# Altium schematic sheet PP_2_0_1.SchDoc
size 209 x 297 mm; PageSetup: Record=PageOptions|CenterHorizontal=True|CenterVertical=True|PrintScale=0.94|XCorrection=1.00|YCorrection=1.00|PrintKind=2|BorderSize=5000000|LeftOffset=0|BottomOffset=0|Orientation=1|PaperLength=2970|PaperWidth=2100|Scale=100|PaperSource=7|PrintQuality=600|MediaType=1|DitherType=10|PaperKind=A4|PrintScaleMode=1; Title1str: (вторая строка при необходимости); DocumentType: Тип схемы; DocumentNumber: 53251498.468331.01.04.00 Э3; SheetNumber: 2; Format: A4
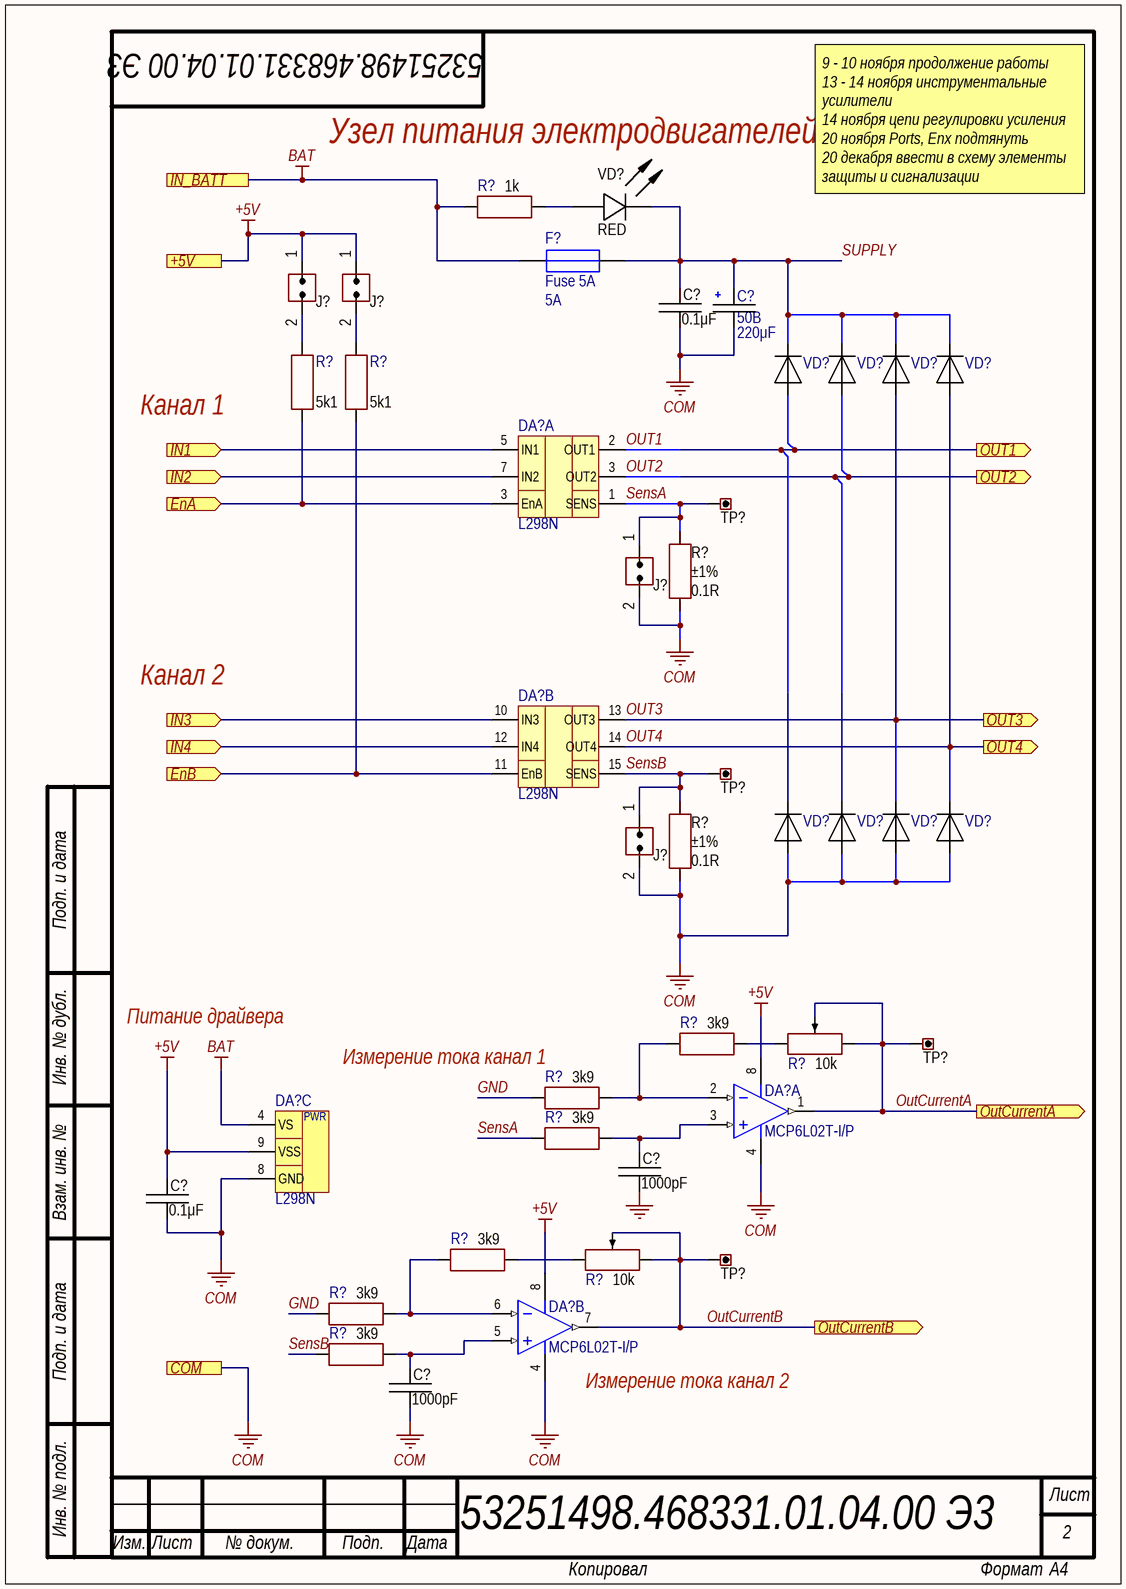
[diagram p0: PP_2_0_1.SchDoc]

## Parts
(Parts that share a designator on the sheet are numbered #1, #2 ... from top to bottom, then left to right.)
C?#1  value 0.1μF  [CAP: 0805, Thru-Hole]
C?#2  value 220μF  Voltage: 50В  [CAP: RB2-5]  (hidden comment: Cap Pol1)
C?#3  value 1000pF  [CAP: 0805, Thru-Hole]
C?#4  value 0.1μF  [CAP: 0805, Thru-Hole]
C?#5  value 1000pF  [CAP: 0805, Thru-Hole]
DA?#1  L298N  [Multivatt15]  (part A of 3)
DA?#2  L298N  [Multivatt15]  (part B of 3)
DA?#3  MCP6L02T-I/P  [DIP-8]  (part A of 2)
DA?#4  L298N  [Multivatt15]  (part C of 3)
DA?#5  MCP6L02T-I/P  [DIP-8]  (part B of 2)
F?  Fuse 5A  value 5A  [FUSE:MF-R_Style_2]
J?#1  (no value)  [CON: PLS-2]
J?#2  (no value)  [CON: PLS-2]
J?#3  (no value)  [CON: PLS-2]
J?#4  (no value)  [CON: PLS-2]
R?#1  value 1k  [RES:CF-1/4W]
R?#2  value 5k1  [RES:CF-1/4W]
R?#3  value 5k1  [RES:CF-1/4W]
R?#4  value 0.1R  Tolerance: ±1%  [RES:CF-1/1W]
R?#5  value 0.1R  Tolerance: ±1%  [RES:CF-1/1W]
R?#6  value 3k9  [RES:CF-1/4W]
R?#7  value 10k  [RES: 3296W]
R?#8  value 3k9  [RES:CF-1/4W]
R?#9  value 3k9  [RES:CF-1/4W]
R?#10  value 3k9  [RES:CF-1/4W]
R?#11  value 10k  [RES: 3296W]
R?#12  value 3k9  [RES:CF-1/4W]
R?#13  value 3k9  [RES:CF-1/4W]
TP?#1  (no value)  [CON: 5000 (Keystone)]
TP?#2  (no value)  [CON: 5000 (Keystone)]
TP?#3  (no value)  [CON: 5000 (Keystone)]
TP?#4  (no value)  [CON: 5000 (Keystone)]
VD?#1  Color: RED  [LED: 3MM_301_R]
VD?#2  (no value)  [DIODE: DO-41]
VD?#3  (no value)  [DIODE: DO-41]
VD?#4  (no value)  [DIODE: DO-41]
VD?#5  (no value)  [DIODE: DO-41]
VD?#6  (no value)  [DIODE: DO-41]
VD?#7  (no value)  [DIODE: DO-41]
VD?#8  (no value)  [DIODE: DO-41]
VD?#9  (no value)  [DIODE: DO-41]

## Ports
+5V, COM, EnA (in), EnB (in), IN1 (in), IN2 (in), IN3 (in), IN4 (in), IN_BATT, OUT1 (out), OUT2 (out), OUT3 (out), OUT4 (out), OutCurrentA (out), OutCurrentB (out)

## Nets
+5V: C?#4.2 DA?#3.8(VDD) DA?#4.9(VSS) DA?#5.8(VDD) J?#1.1(IN) J?#2.1(IN) ; port +5V
BAT: DA?#4.4(VS) F?.1 R?#1.1 ; port IN_BATT
COM: C?#1.1 C?#2.1 C?#3.1 C?#4.1 C?#5.1 DA?#3.4(VSS) DA?#4.8(GND) DA?#5.4(VSS) J?#3.2(IN) J?#4.2(IN) R?#4.1 R?#5.1 VD?#6.1 VD?#7.1 VD?#8.1 VD?#9.1 ; port COM
EnA: DA?#1.3(EnA) R?#2.1 ; port EnA
EnB: DA?#2.11(EnB) R?#3.1 ; port EnB
GND: R?#8.1 R?#12.1
IN1: DA?#1.5(IN1) ; port IN1
IN2: DA?#1.7(IN2) ; port IN2
IN3: DA?#2.10(IN3) ; port IN3
IN4: DA?#2.12(IN4) ; port IN4
OUT1: DA?#1.2(OUT1) VD?#2.1 VD?#6.2 ; port OUT1
OUT2: DA?#1.3(OUT2) VD?#3.1 VD?#7.2 ; port OUT2
OUT3: DA?#2.13(OUT3) VD?#4.1 VD?#8.2 ; port OUT3
OUT4: DA?#2.14(OUT4) VD?#5.1 VD?#9.2 ; port OUT4
OutCurrentA: DA?#3.1(VOUTA) R?#7.2 R?#7.3 TP?#3.1 ; port OutCurrentA
OutCurrentB: DA?#5.7(VOUTB) R?#11.2 R?#11.3 TP?#4.1 ; port OutCurrentB
SensA: DA?#1.1(SENS) J?#3.1(IN) R?#4.2 R?#9.1 TP?#1.1
SensB: DA?#2.15(SENS) J?#4.1(IN) R?#5.2 R?#13.1 TP?#2.1
SUPPLY: C?#1.2 C?#2.2 F?.2 VD?#1.2(C) VD?#2.2 VD?#3.2 VD?#4.2 VD?#5.2
NetC?#3_2: C?#3.2 DA?#3.3(VINA+) R?#9.2
NetC?#5_2: C?#5.2 DA?#5.5(VINB+) R?#13.2
NetDA?#3_2: DA?#3.2(VINA-) R?#6.1 R?#8.2
NetDA?#5_6: DA?#5.6(VINB-) R?#10.1 R?#12.2
NetJ?#1_2: J?#1.2(IN) R?#2.2
NetJ?#2_2: J?#2.2(IN) R?#3.2
NetR?#1_2: R?#1.2 VD?#1.1(A)
NetR?#6_2: R?#6.2 R?#7.1
NetR?#10_2: R?#10.2 R?#11.1

## Notes on the sheet
- Узел питания электродвигателей
- 9 - 10 ноября продолжение работы
  13 - 14 ноября инструментальные усилители
  14 ноября цепи регулировки усиления
  20 ноября Ports, Enx подтянуть
  20 декабря ввести в схему элементы защиты и сигнализации
- Канал 1
- Канал 2
- Питание драйвера
- (near R?#8) Измерение тока канал 1
- (near DA?#5) Измерение тока канал 2
- Подп. и дата
- Инв. № дубл.
- Взам. инв. №
- Инв. № подл.
- Лист
- Изм.
- № докум.
- Подп.
- Дата
- Копировал
- Формат
- (in symbol L298N, part C) PWR

## Library data of the parts
C?#1 C?#4 = Ceramic_0805: К10-17 0805; Manufacturer: Murata; PartNumber: RPEE41H105M3M1C05A; ValueManufacturerPartNumber: Ceramic capacitor, 0.1μF, X7R, ±10%, 50V, 1206, -55...+125°C; TypeCapacitor: Ceramic capacitor; Tolerance: ±10%; TypeDielectric: X7R; Voltage: 50V; Package: 1206; HelpURL: https://www.chipdip.ru/product/rpee41h105m3; Temperature: -55...+125°C
C?#2 = Cap Pol1: ECAP (К50-35), 220мкФ, 50В, 105°C, 20%, 10x12мм P:5мм; Partnumber: JRB1H221M05001000120000B; Pitch: 5mm; Published: 8-Jun-2000; LatestRevisionDate: 17-Jul-2002; LatestRevisionNote: Re-released for DXP Platform.; PackageReference: RB5-10; Publisher: Altium Limited; PackageDescription: Polarized Capacitor (Radial); 2 Leads
C?#3 C?#5 = Ceramic_0805: К10-17Б имп. 1000пФ X7R,10%,0805, Конденсатор керамический выводной; Manufacturer: Murata; PartNumber: RPEE41H105M3M1C05A; ValueManufacturerPartNumber: Ceramic capacitor, 1000pF, X7R, ±10%, 50V, 0805, -55...+125°C; TypeCapacitor: Ceramic capacitor; Voltage: 50V; Package: 0805; HelpURL: https://www.chipdip.ru/product/rpee41h105m3; Temperature: -55...+125°C; Tolerance: ±10%; TypeDielectric: X7R
DA?#1 DA?#2 DA?#4 = L298N: L298N, Двойной полномостовой драйвер [Multiwatt-15, Vertical]
DA?#3 DA?#5 = MCP6L02T-I/P: MCP602-I/P, 2-х канальный ОУ с однополярным питанием, 2.7В…5.5В, [DIP-8]; Published: 2-Dec-2009; DatasheetVersion: revA, Mar-2009; PackageVersion: revBB, Aug-2009; PackageReference: DIP-8; Publisher: Altium Limited; PackageDescription: 8-Lead Plastic Small Outline (SN) - Narrow, 3.90mm Body [SOIC]; Supplier 1: Digi-Keyhttps://www.chipdip.ru/product/mcp602-i-p; Supplier Part Number 1: MCP602-I/P; Supplier 2: Digi-Key; Supplier Part Number 2: MCP6L02T-E/SNCT-ND; Supplier 3: Digi-Key; Supplier Part Number 3: MCP6L02T-E/SNDKR-ND; Supplier 4: Farnell; Supplier Part Number 4: 1715882; Code_JEDEC: MS-012; Code_IPC: SOIC127P600-8; ComponentLink1Description: Datasheet; ComponentLink1URL: http://ww1.microchip.com/downloads/en/DeviceDoc/22140a.pdf; ComponentLink2Description: Packaging Specification; ComponentLink2URL: http://www.microchip.com/stellent/groups/techpub_sg/documents/packagingspec/en012702.pdf; ComponentLink3Description: Microchip.com Home; ComponentLink3URL: http://www.microchip.com/
J?#1-J?#4 = Jumper_single: CommentText: "Перемычка"
R?#1 = Resistor_CF-25: MF-25 (С2-23) 0.25 Вт, 1кОм, 5%, Резистор металлопленочный; Manufacturer: Yageo; PartNumber: CF-1/4W-1KJ; ValueManufacturerPartNumber: Resistor film, 1k, ±5%, CF-25, 0.25W, -55...+125°C; TypeResistor: Resistor film; Power: 0.25W; Package: CF-25; HelpURL: https://www.chipdip.ru/product0/44435; Temperature: -55...+125°C; Tolerance: ±5%
R?#2 R?#3 = Resistor_CF-25: CF-25 (С1-4) 0.25 Вт, 5.1 кОм, 5%, Резистор углеродистый; Manufacturer: Yageo; PartNumber: CF-1/4W-5K1J; ValueManufacturerPartNumber: Resistor film, 5k1, ±5%, CF-25, 0.25W, -55...+125°C; TypeResistor: Resistor film; Power: 0.25W; Package: CF-25; HelpURL: https://www.chipdip.ru/product0/57331; Temperature: -55...+125°C; Tolerance: ±5%
R?#4 R?#5 = Resistor_CF-100: KNP-100 1 Вт, 0.1 Ом, 5%, Резистор проволочный; Manufacturer: Yageo; PartNumber: KNP-1W-0R1J; ValueManufacturerPartNumber: Resistor film, 0.1R, ±1%, CF-100, 1W, -55...+125°C; TypeResistor: Resistor film; Power: 1W; Package: CF-100; HelpURL: https://www.digikey.com/product-detail/en/yageo/RC0201JR-07100RL/311-100NCT-ND/1949006; Temperature: -55...+125°C
R?#6 R?#8-R?#10 R?#12 R?#13 = Resistor_CF-25: MF-25 (С2-23) 0.25 Вт, 3.9 кОм, 1%, Резистор металлопленочный; Manufacturer: Yageo; PartNumber: MF-1/4W-3K9F; ValueManufacturerPartNumber: Resistor film, 3k9, ±1%, CF-25, 0.25W, -55...+125°C; TypeResistor: Resistor film; Power: 0.25W; Package: CF-25; HelpURL: https://www.chipdip.ru/product0/57331; Temperature: -55...+125°C; Tolerance: ±1%
R?#7 R?#11 = Trimmer: Manufacturer: Bourns; PartNumber: 3296W-1-103LF; ValueManufacturerPartNumber: Resistor film, 10k, ±10%, 3296W, 0.5W, -55...+125°C; TypeResistor: Resistor film; Power: 0.5W; Tolerance: ±10%; Package: 3296W; HelpURL: https://www.digikey.com/product-detail/en/bourns-inc/3296W-1-103LF/3296W-103LF-ND/1088045; Temperature: -55...+125°C
TP?#1-TP?#4 = Connector_Test_Point: Manufacturer: Keystone; ValueManufacturerPartNumber: Test point, Keystone, 5001; PartNumber: 5001; TypeConnector: Test point; HelpURL: https://www.digikey.com/product-detail/en/keystone-electronics/5001/36-5001-ND/255327
VD?#1 = LED_single: ValueManufacturerPartNumber: LED, RED, *, *, *, -55...+150°C; PartNumber: L-1503CB/1ID; TypeDiode: LED; Manufacturer: *; Package: *; HelpURL: *; Temperature: -55...+150°C; Current: *; VoltageDrop: *; ColorParameter: RED
VD?#2-VD?#9 = 1N4007: Manufacturer: Micro Commercial; ValueManufacturerPartNumber: Single diode, 1000V, 1A, 1V, 4ns, DO-41, -55...+150°C; TypeDiode: Single diode; Voltage: 1000V; Current: 1A; VoltageDrop: 1V; RecoveryTime: 4ns; Package: DO-41; HelpURL: https://www.chipdip.ru/product/1n4007; Temperature: -55...+150°C; PartNumber: 1N4007
F? = Fuse 5A: Published: 8-Jun-2000; LatestRevisionDate: 17-Jul-2002; LatestRevisionNote: Re-released for DXP Platform.; PackageReference: PIN-W2/E2.8; Publisher: Altium Limited; PackageDescription: Thru-Hole; 2 Leads